# EasyEDA schematic connect 4.json
TITLE: Sheet_1; REV: 1.0; Date: 2026-02-12; Sheet: 1/1; Company: Your Company
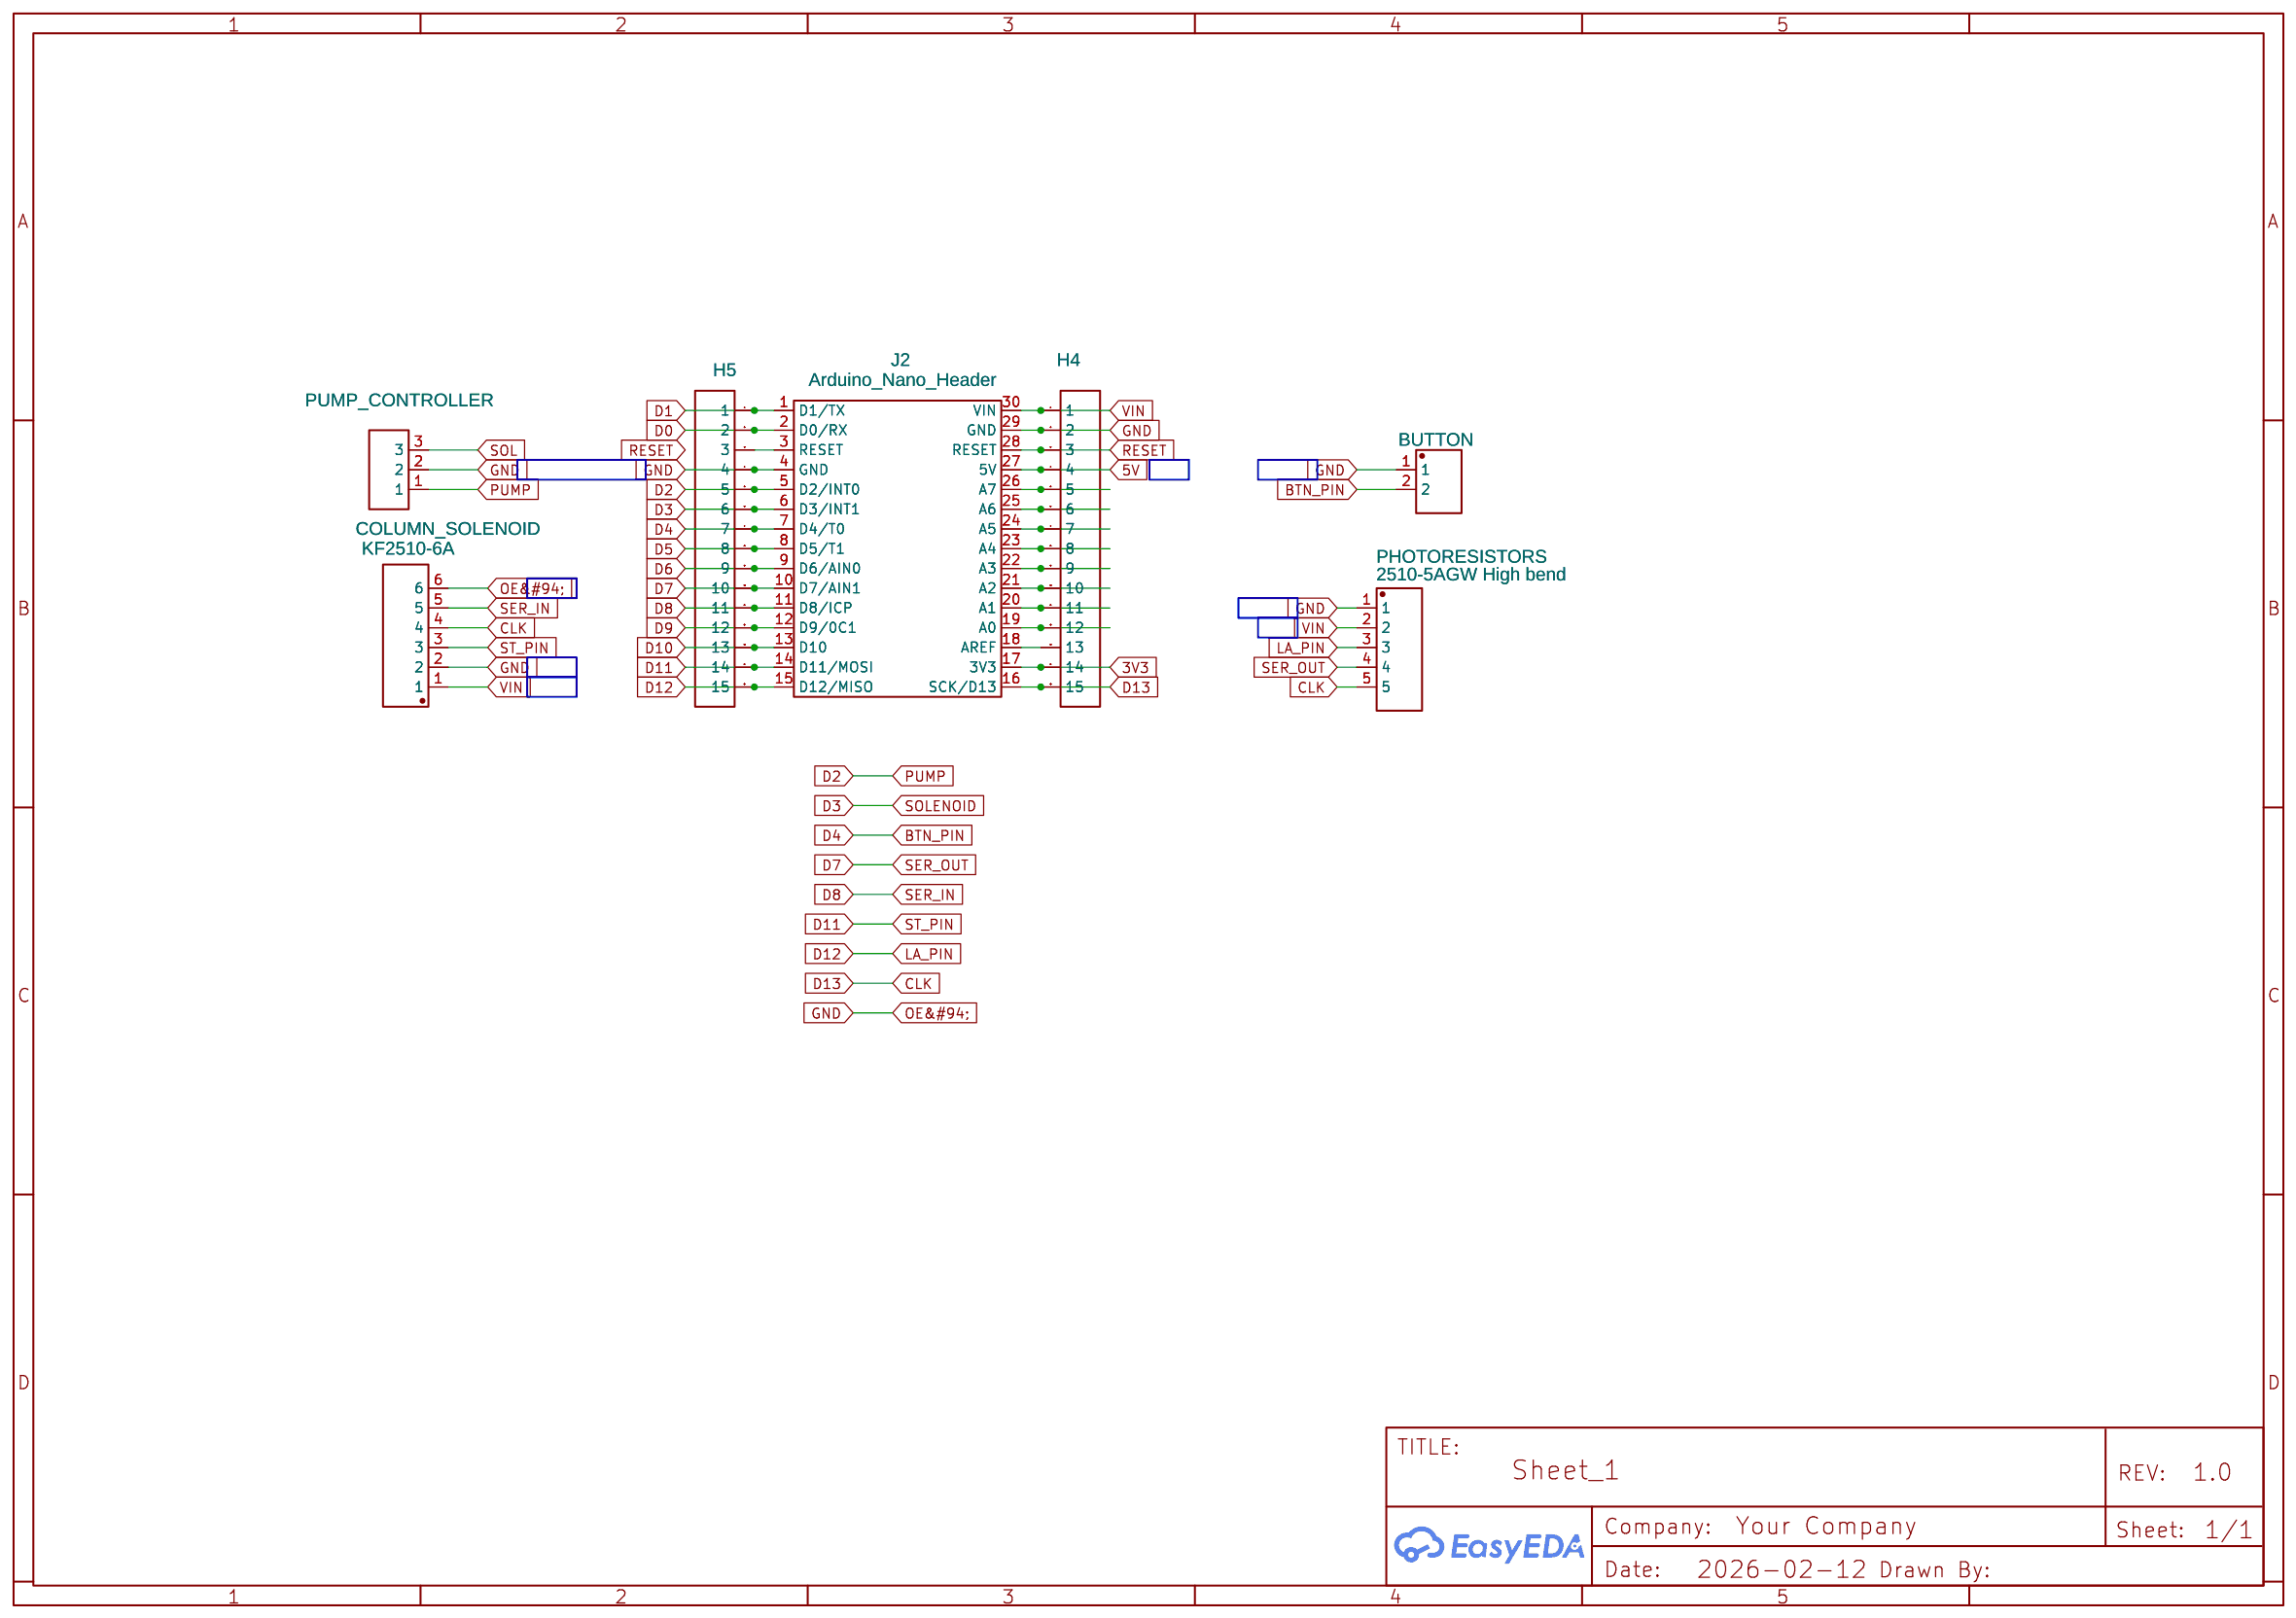
[diagram p0: schematic sheet]

## Parts
COLUMN_SOLENOID  KF2510-6A  [CONN-TH_KF2510-6A]
D3  BUTTON  [CONN-TH_KF2510-2A]
H4  HDR-F-2.54_1x15  [HDR-F-2.54_1X15]
H5  HDR-F-2.54_1x15  [HDR-F-2.54_1X15]
J2  Arduino_Nano_Header  [DIP-30_L43.18-W15.24-ARDUINONANO]
PHOTORESISTORS  2510-5AGW High bend  [CONN-TH_KF2510-5AGW]
PUMP_CONTROLLER  FK2510  [CONN-TH_3P-P2.00_KF2510_3A]

## Library data of the parts
COLUMN_SOLENOID = KF2510-6A: Supplier Part: C27545; Supplier: LCSC; Manufacturer: null; Manufacturer Part: KF2510-6A针座; JLCPCB Part Class: Extended Part
D3 = KF2510-2A: Supplier: LCSC; Manufacturer: BOOMELE; Supplier Part: C27543; JLCPCB Part Class: Extended Part; Package Display: No
H4 H5 = HDR-F-2.54_1x15: Supplier Part: C124408; Supplier: LCSC; Contributor: LCEDA_Lib; Package Display: No
J2 = Arduino_Nano_Header
PHOTORESISTORS = 2510-5AGW High bend: Supplier: LCSC; Manufacturer: BOOMELE(博穆精密); Manufacturer Part: 2510-5A高弯; Supplier Part: C61410; JLCPCB Part Class: Extended Part
PUMP_CONTROLLER = kf2510_3A: JLCPCB Part Class: Extended Part; Package Display: No

## Nets
3V3: H4.14 J2.17(3V3)
5V: H4.4 J2.27(5V)
GND: COLUMN_SOLENOID.2 COLUMN_SOLENOID.6 D3.1 H4.2 H5.4 J2.4(GND) J2.29(GND) PHOTORESISTORS.1 PUMP_CONTROLLER.2
VIN: COLUMN_SOLENOID.1 H4.1 J2.30(VIN) PHOTORESISTORS.2
BTN_PIN: D3.2 H5.7 J2.7(D4/T0)
CLK: COLUMN_SOLENOID.4 H4.15 J2.16(SCK/D13) PHOTORESISTORS.5
D0: H5.2 J2.2(D0/RX)
D1: H5.1 J2.1(D1/TX)
D2: H5.5 J2.5(D2/INT0) PUMP_CONTROLLER.1
D3: H5.6 J2.6(D3/INT1)
D5: H5.8 J2.8(D5/T1)
D6: H5.9 J2.9(D6/AIN0)
D7: H5.10 J2.10(D7/AIN1) PHOTORESISTORS.4
D8: COLUMN_SOLENOID.5 H5.11 J2.11(D8/ICP)
D9: H5.12 J2.12(D9/0C1)
D10: H5.13 J2.13(D10)
D11: COLUMN_SOLENOID.3 H5.14 J2.14(D11/MOSI)
D12: H5.15 J2.15(D12/MISO) PHOTORESISTORS.3
RESET: H4.3 J2.28(RESET)
SOL: PUMP_CONTROLLER.3
Net-(H4-5): H4.5 J2.26(A7)
Net-(H4-6): H4.6 J2.25(A6)
Net-(H4-7): H4.7 J2.24(A5)
Net-(H4-8): H4.8 J2.23(A4)
Net-(H4-9): H4.9 J2.22(A3)
Net-(H4-10): H4.10 J2.21(A2)
Net-(H4-11): H4.11 J2.20(A1)
Net-(H4-12): H4.12 J2.19(A0)
Net-(H4-13): H4.13 J2.18(AREF)
Net-(H5-3): H5.3 J2.3(RESET)
